# Altium schematic sheet Accelerometer.SchDoc
size 420 x 297 mm
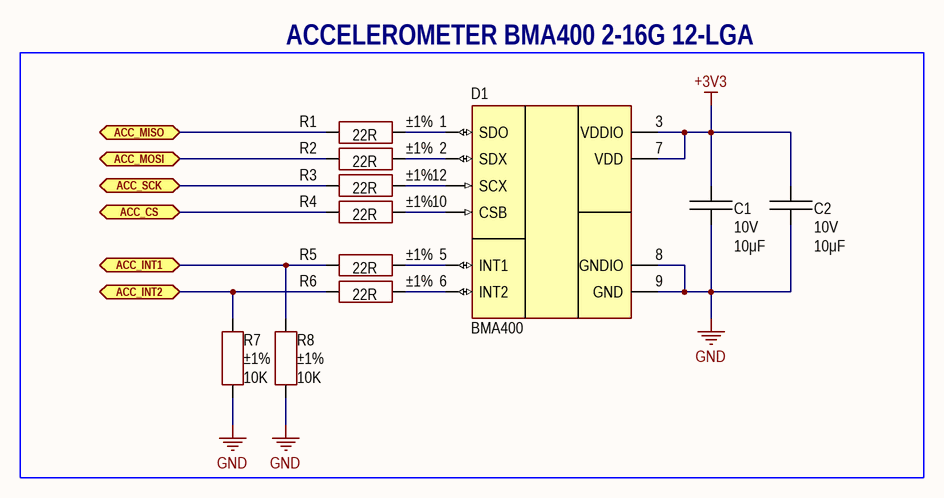
[diagram p0: Accelerometer.SchDoc]

## Parts
C1  value 10μF  Voltage: 10V  [CAP: 0805]
C2  value 10μF  Voltage: 10V  [CAP: 0805]
D1  (no value)  [12-VFLGA]
R1  value 22R  Tolerance: ±1%  [RES: 0805]
R2  value 22R  Tolerance: ±1%  [RES: 0805]
R3  value 22R  Tolerance: ±1%  [RES: 0805]
R4  value 22R  Tolerance: ±1%  [RES: 0805]
R5  value 22R  Tolerance: ±1%  [RES: 0805]
R6  value 22R  Tolerance: ±1%  [RES: 0805]
R7  value 10K  Tolerance: ±1%  [RES: 0805]
R8  value 10K  Tolerance: ±1%  [RES: 0805]

## Blocks framed on the sheet
ACCELEROMETER BMA400 2-16G 12-LGA: C1 C2 D1 R1-R8

## Ports
ACC_CS (bidir), ACC_INT1 (bidir), ACC_INT2 (bidir), ACC_MISO (bidir), ACC_MOSI (bidir), ACC_SCK (bidir)

## Nets
+3V3: C1.2 C2.2 D1.3(VDDIO) D1.7(VDD)
GND: C1.1 C2.1 D1.8(GNDIO) D1.9(GND) R7.1 R8.1
ACC_CS: R4.1 ; port ACC_CS
ACC_INT1: R5.1 R8.2 ; port ACC_INT1
ACC_INT2: R6.1 R7.2 ; port ACC_INT2
ACC_MISO: R1.1 ; port ACC_MISO
ACC_MOSI: R2.1 ; port ACC_MOSI
ACC_SCK: R3.1 ; port ACC_SCK
NetD1_1: D1.1(SDO) R1.2
NetD1_2: D1.2(SDX) R2.2
NetD1_5: D1.5(INT1) R5.2
NetD1_6: D1.6(INT2) R6.2
NetD1_10: D1.10(CSB) R4.2
NetD1_12: D1.12(SCX) R3.2

## Notes on the sheet
- Author
- Manufacturer
- Date
- Page
- Total pages
- Size page
- A3
- Materials

## Library data of the parts
C1 C2 = Ceramic_0805: 10 µF ±10% 10V Ceramic Capacitor X7R 0805 (2012 Metric); Manufacturer: Yageo; PartNumber: CC0805KFX7R6BB106; ValueManufacturerPartNumber: Ceramic capacitor, 10μF, X7R, ±10%, 10V, 0805, -55...+125°C; Package: 0805; HelpURL: https://www.digikey.com/en/products/detail/yageo/CC0805KFX7R6BB106/11611326; Temperature: -55...+125°C; TypeCapacitor: Ceramic capacitor; Tolerance: ±10%; TypeDielectric: X7R
D1 = BMA400: Accelerometer; Manufacturer: Bosch Sensortec; Supply: 1.72...3.6V; Sensing: Digital sensor; HelpURL: https://www.digikey.com/en/products/detail/bosch-sensortec/BMA400/8634941; Package: 12-VFLGA; ComponentType: IC accelerometer; ValueManufacturerPartNumber: =ComponentType+', '+Sensing+', '+Accuracy+', '+GainBandwidth+', '+Sensitivity+', '+Temperature+', '+Package; Temperature: -40...+85°C; PartNumber: BMA400
R1-R6 = Resistor_0805: 22 Ohms ±1% 0.125W, 1/8W Chip Resistor 0805 (2012 Metric) Moisture Resistant Thick Film; Manufacturer: Yageo; PartNumber: RC0805FR-0722RL; ValueManufacturerPartNumber: Resistor film, 22R, ±1%, 0805, 0.125W, -55...+125°C; TypeResistor: Resistor film; Package: 0805; HelpURL: https://www.digikey.com/en/products/detail/yageo/RC0805FR-0722RL/727735; Temperature: -55...+125°C; Power: 0.125W
R7 R8 = Resistor_0805: 10 kOhms ±1% 0.125W, 1/8W Chip Resistor 0805 (2012 Metric) Moisture Resistant Thick Film; Manufacturer: Yageo; PartNumber: RC0805FR-0710KL; ValueManufacturerPartNumber: Resistor film, 10K, ±1%, 0805, 0.125W, -55...+125°C; TypeResistor: Resistor film; Package: 0805; HelpURL: https://www.digikey.com/en/products/detail/yageo/RC0805FR-0710KL/727535; Temperature: -55...+125°C; Power: 0.125W